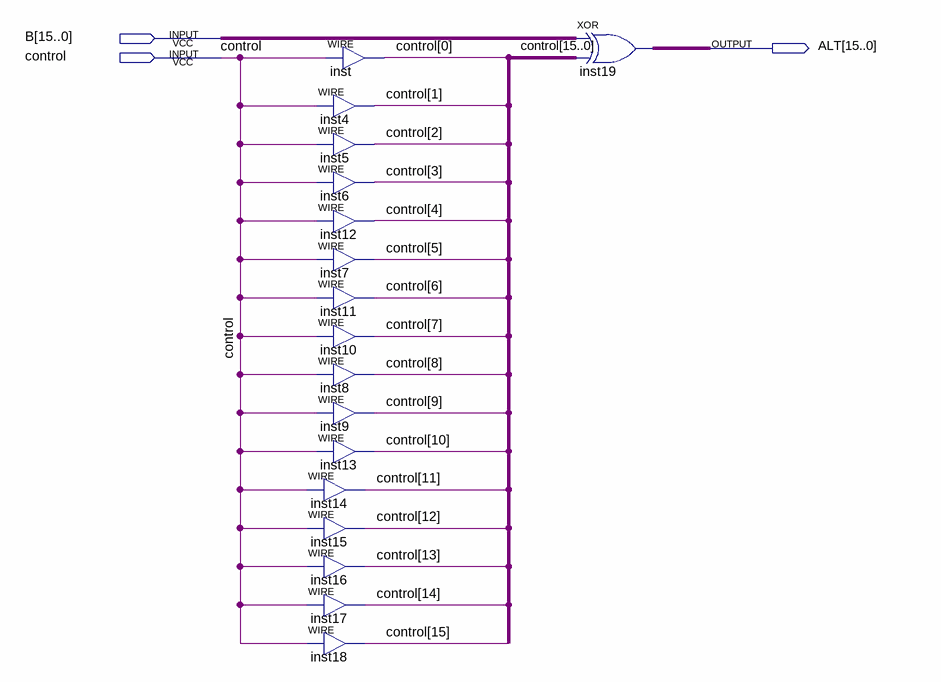
[diagram p0: schematic sheet]
// Quartus schematic converter.bdf as structural Verilog: 17 symbols, 3 pins
module converter (
  input  [15:0] B,
  input  control,
  output [15:0] ALT
);

  wire [15:0] control_bus;

  assign control_bus[0] = control;  // WIRE inst
  assign control_bus[1] = control;  // WIRE inst4
  assign control_bus[2] = control;  // WIRE inst5
  assign control_bus[3] = control;  // WIRE inst6
  assign control_bus[4] = control;  // WIRE inst12
  assign control_bus[5] = control;  // WIRE inst7
  assign control_bus[6] = control;  // WIRE inst11
  assign control_bus[7] = control;  // WIRE inst10
  assign control_bus[8] = control;  // WIRE inst8
  assign control_bus[9] = control;  // WIRE inst9
  assign control_bus[10] = control;  // WIRE inst13
  assign control_bus[11] = control;  // WIRE inst14
  assign control_bus[12] = control;  // WIRE inst15
  assign control_bus[13] = control;  // WIRE inst16
  assign control_bus[14] = control;  // WIRE inst17
  assign control_bus[15] = control;  // WIRE inst18
  assign ALT = B ^ control_bus;  // XOR inst19, 16 bits wide
endmodule
